# EAGLE design helloGame1.5 (EAGLE 8.6.3)
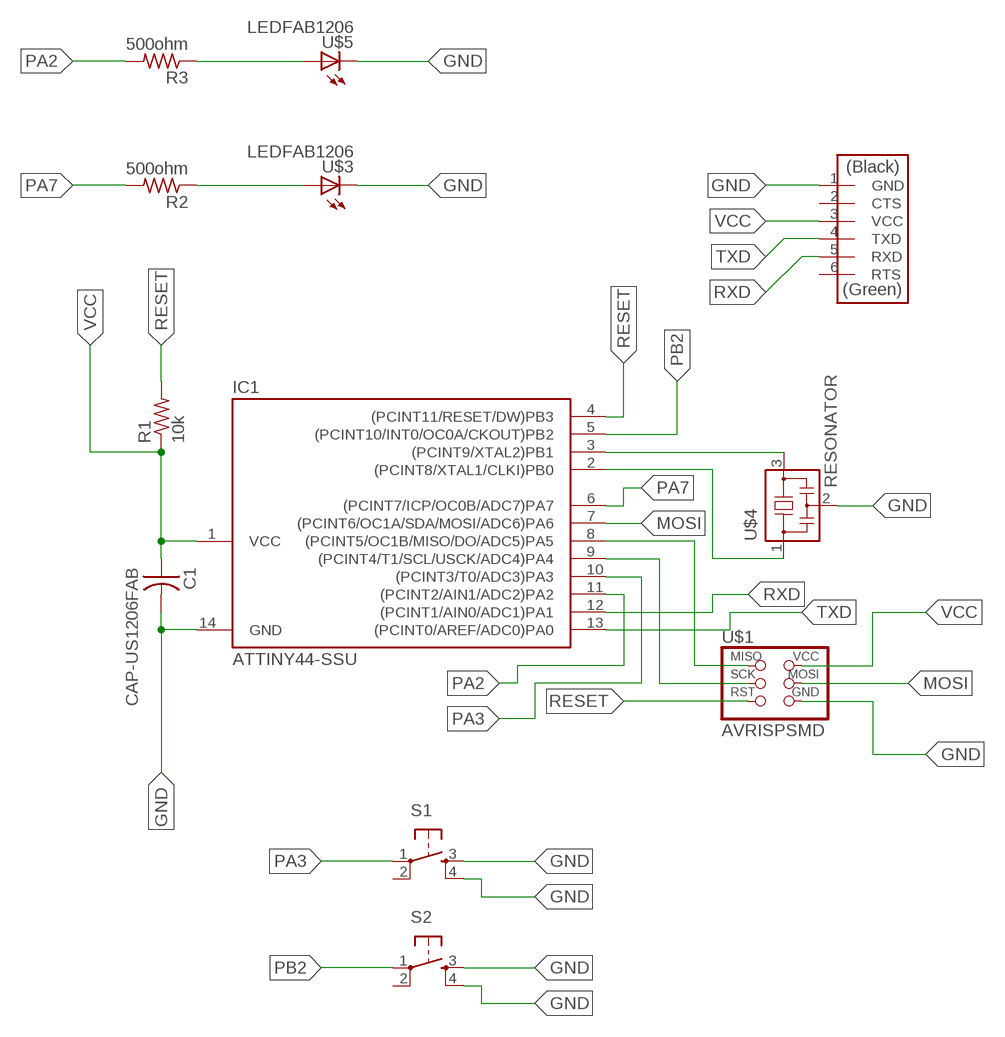
[diagram p0: schematic, sheet 1]

## Parts
C1  CAP-US1206FAB  [C1206FAB]
IC1  ATTINY44-SSU  [SOIC14]
R1  10k  RES-US1206FAB  [R1206FAB]
R2  500ohm  RES-US1206FAB  [R1206FAB]
R3  500ohm  RES-US1206FAB  [R1206FAB]
S1  6MM_SWITCH6MM_SWITCH  [6MM_SWITCH]
S2  6MM_SWITCH6MM_SWITCH  [6MM_SWITCH]
U$1  AVRISPSMD  [2X03SMD]
U$2  FTDI-SMD-HEADER  [1X06SMD]
U$3  LEDFAB1206  [LED1206FAB]
U$4  RESONATOR  [EFOBM]
U$5  LEDFAB1206  [LED1206FAB]

## Nets
GND: C1.2 IC1.14(GND) S1.3(S) S1.4(S1) S2.3(S) S2.4(S1) U$1.6(GND) U$2.1(GND) U$3.2(C) U$4.2 U$5.2(C)
MOSI: IC1.7((PCINT6/OC1A/SDA/MOSI/ADC6)PA6) U$1.4(MOSI)
N$2: IC1.3((PCINT9/XTAL2)PB1) U$4.3
N$3: IC1.2((PCINT8/XTAL1/CLKI)PB0) U$4.1
N$5: IC1.9((PCINT4/T1/SCL/USCK/ADC4)PA4) U$1.3(SCK)
N$6: IC1.8((PCINT5/OC1B/MISO/DO/ADC5)PA5) U$1.1(MISO)
N$7: R3.1 U$5.1(A)
N$11: R2.1 U$3.1(A)
PA2: IC1.11((PCINT2/AIN1/ADC2)PA2) R3.2
PA3: IC1.10((PCINT3/T0/ADC3)PA3) S1.1(P)
PA7: IC1.6((PCINT7/ICP/OC0B/ADC7)PA7) R2.2
PB2: IC1.5((PCINT10/INT0/OC0A/CKOUT)PB2) S2.1(P)
RESET: IC1.4((PCINT11/RESET/DW)PB3) R1.2 U$1.5(RST)
RXD: IC1.12((PCINT1/AIN0/ADC1)PA1) U$2.5(RXD)
TXD: IC1.13((PCINT0/AREF/ADC0)PA0) U$2.4(TXD)
VCC: C1.1 IC1.1(VCC) R1.1 U$1.2(VCC) U$2.3(VCC)
Unconnected: S1.2(P1) S2.2(P1) U$2.2(CTS) U$2.6(RTS)

## Library data of the parts
C1 = fab:CAP-US
IC1 = fab:ATTINY44
R1-R3 = fab:RES-US: Resistor (US Symbol) Variants with postfix FAB are widened to allow the routing of internal traces
S1 S2 = fab:6MM_SWITCH: OMRON SWITCH
U$1 = fab:AVRISP
U$2 = fab:FTDI-SMD-HEADER
U$3 U$5 = fab:LED: LED
U$4 = fab:RESONATOR

## Board
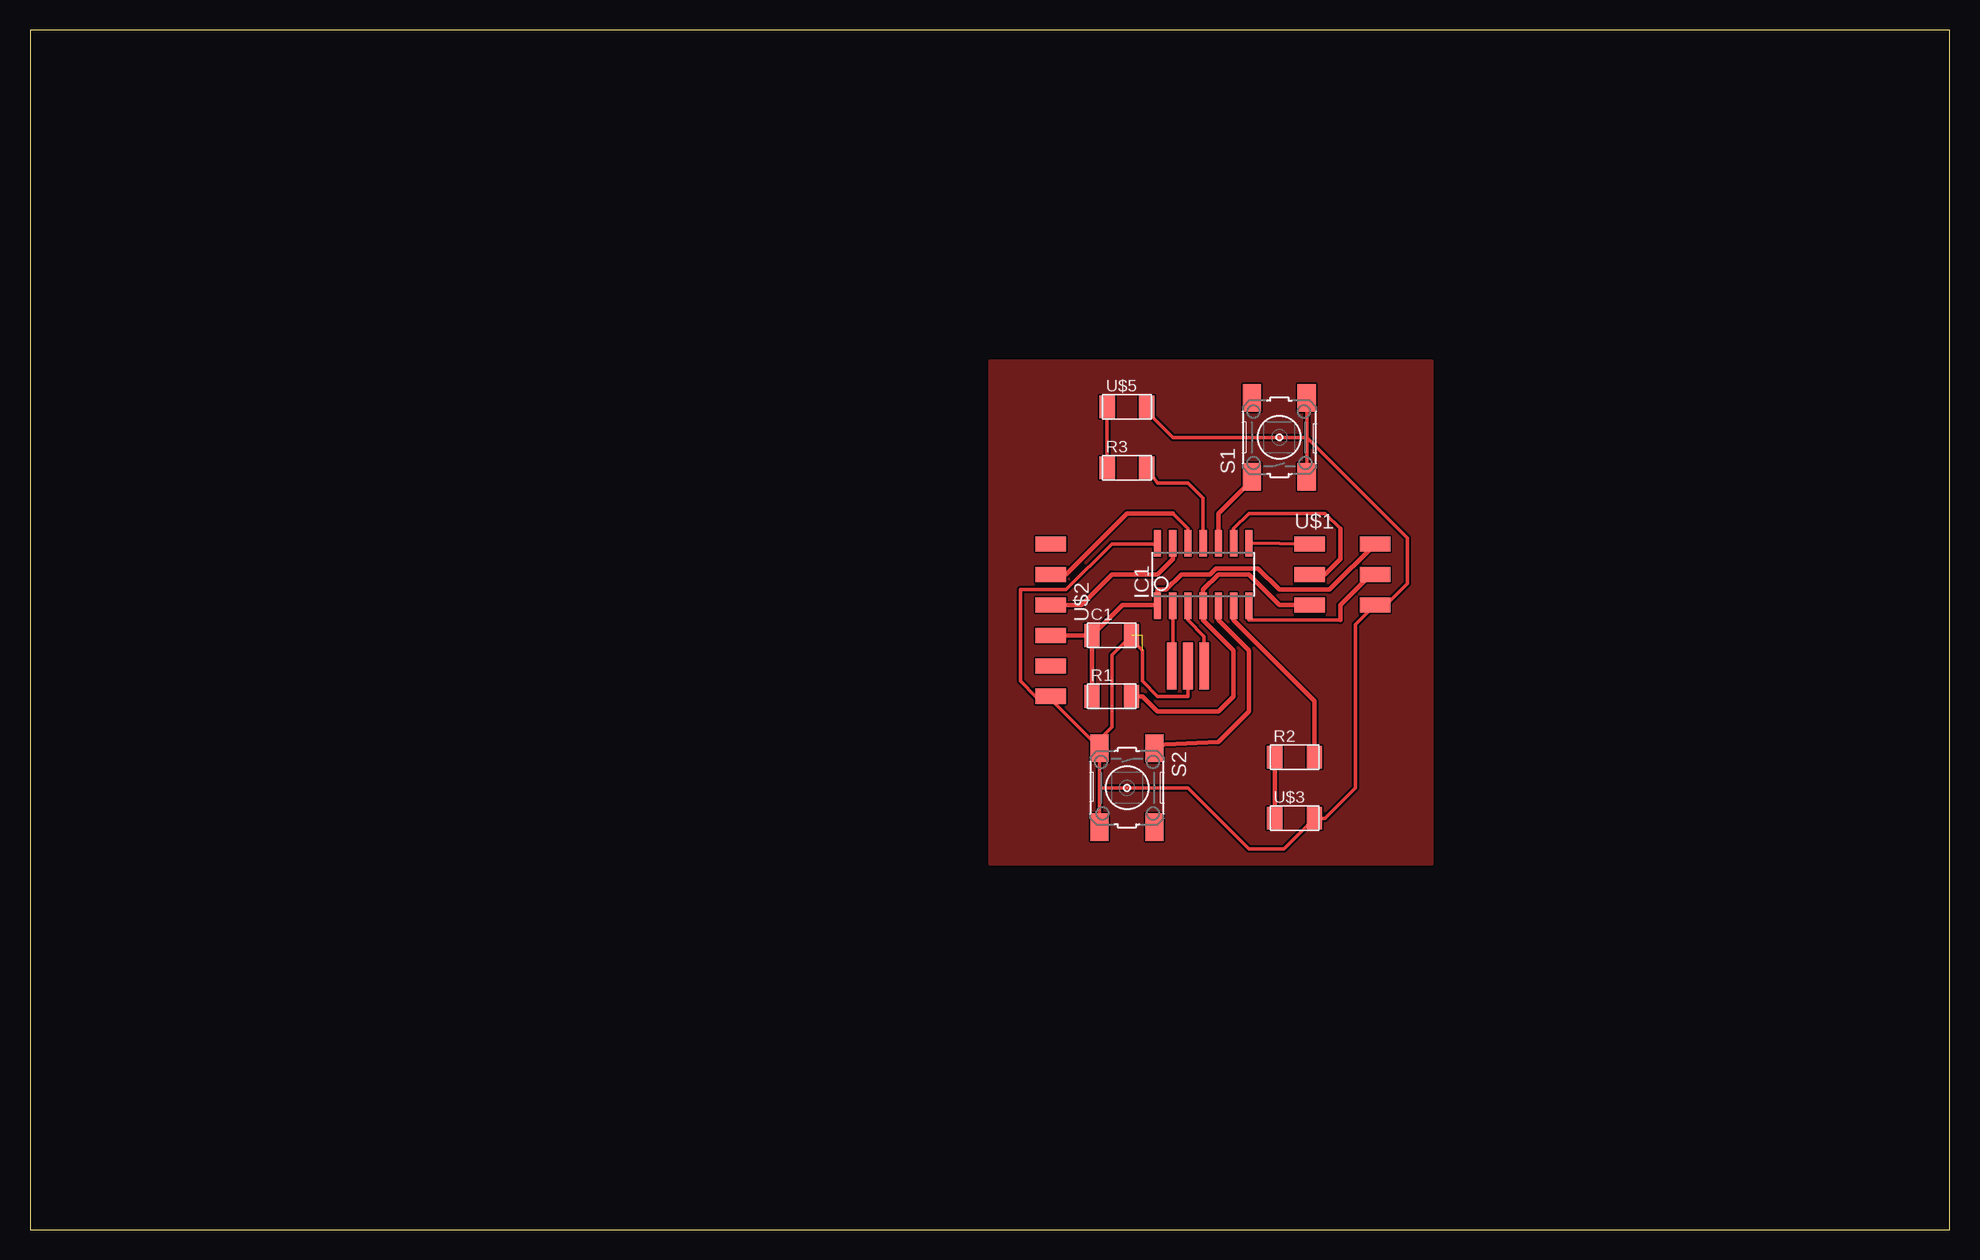
[diagram p1: board, top side]

Size 160 x 100 mm. Coordinates in mm from the lower left corner, seen from the top.
Outline: 0,0 160,0 160,100 0,100 0,0
Copper layers (1*16): Top 0.035mm / dielectric 1.5mm / Bottom 0.035mm
Design rules "default": minimum track width 6mil, minimum drill 0.35mm, track to track 6mil, track to pad 6mil, pad to pad 6mil, via to via 6mil, smd to smd 6mil, copper to edge 40mil, drill to drill 6mil, minimum pad ring 10mil, minimum via ring 8mil, stop-mask expansion 4mil, vias tented up to drill 0mil, thermal gap 10mil

### Footprints (pad centres in the part's own frame; a part is rotated, then mirrored left to right if it is on the bottom)
C1206FAB = smd 1.27 x 1.905: 1 -1.651,0; 2 1.651,0
SOIC14 = smd 0.61 x 2.21: 1 -3.81,-2.603; 2 -2.54,-2.603; 3 -1.27,-2.603; 4 0,-2.603; 5 1.27,-2.603; 6 2.54,-2.603; 7 3.81,-2.603; 8 3.81,2.603; 9 2.54,2.603; 10 1.27,2.603; 11 0,2.603; 12 -1.27,2.603; 13 -2.54,2.603; 14 -3.81,2.603
R1206FAB = smd 1.27 x 1.905: 1 -1.651,0; 2 1.651,0
6MM_SWITCH = smd 2.286 x 1.524: 1 -3.302,2.286; 2 3.302,2.286; 3 -3.302,-2.286; 4 3.302,-2.286
2X03SMD = smd 2.54 x 1.27: 1 -2.54,2.54; 2 2.92,2.54; 3 -2.54,0; 4 2.92,0; 5 -2.54,-2.54; 6 2.92,-2.54
1X06SMD = smd 2.54 x 1.27: 1 0,6.35; 2 0,3.81; 3 0,1.27; 4 0,-1.27; 5 0,-3.81; 6 0,-6.35
LED1206FAB = smd 1.27 x 1.905: 1 -1.651,0; 2 1.651,0
EFOBM = smd 0.8 x 3.9: 1 -1.35,0; 2 0,0; 3 1.35,0

### Placement (x,y rotation side)
C1  90.17,49.53 0 top
IC1  97.79,54.61 0 top
R1  90.17,44.45 0 top
R2  105.41,39.37 0 top
R3  91.44,63.5 0 top
S1  104.14,66.04 90 top
S2  91.44,36.83 270 top
U$1  109.22,54.61 0 top
U$2  85.09,50.8 180 top
U$3  105.41,34.29 0 top
U$4  96.52,46.99 0 top
U$5  91.44,68.58 0 top

### Tracks (layer width: path | path; a pad name or v marks a point on that pad's centre or on a via)
GND  (2 unrouted)
  Top 0.305: IC1.14 93.92,57.15 90.17,57.15 86.36,53.34 82.55,53.34 82.55,45.72 83.82,44.45 U$2.1 85.09,44.2 88.77,40.51 | 88.77,40.51 S2.3 89.15,36.83 | 89.15,36.83 S2.4 | 89.15,36.83 96.52,36.83 101.6,31.75 104.52,31.75 U$3.2 107.95,34.29 110.49,36.83 110.49,50.42 111.95,51.88 | U$1.6 111.95,51.88 | S1.4 106.43,66.04 | 106.43,66.04 S1.3 | 106.43,66.04 95.25,66.04 93.09,68.2 U$5.2 | 106.43,66.04 114.81,57.66 114.81,53.85 112.84,51.88 111.95,51.88 | U$4.2 96.52,44.45 93.98,44.45 92.71,45.72 92.71,48.26 91.63,49.34 | C1.2 91.63,49.34 | 91.63,49.34 90.17,47.88 90.17,41.91 88.77,40.51
MOSI
  Top 0.152: 101.6,50.8 IC1.7
  Top 0.305: 101.6,50.8 109.22,50.8
  Top 0.356: 109.22,50.8 109.22,52.07 111.76,54.61 U$1.4
N$1
  pour Top: 80.01,30.48 80.01,72.39 116.84,72.39 116.84,30.48
N$2
  Top 0.305: U$4.3 97.87,49.45 96.52,50.8 IC1.3
N$3
  Top 0.305: U$4.1 95.25,47.07 IC1.2
N$5
  Top 0.305: 109.22,58.42 107.95,59.69 101.6,59.69 100.33,58.42 IC1.9
  Top 0.356: U$1.3 107.95,54.61 109.22,55.88 109.22,58.42
N$6
  Top 0.305: U$1.1 IC1.8
N$7
  Top 0.305: R3.1 U$5.1
N$11
  Top 0.356: U$3.1 R2.1
PA2
  Top 0.305: IC1.11 97.79,60.96 96.52,62.23 93.98,62.23 R3.2
PA3
  Top 0.356: IC1.10 99.06,59.69 101.85,62.48 S1.1
PA7
  Top 0.356: IC1.6 100.33,50.8 107.06,44.07 R2.2
PB2
  Top 0.356: IC1.5 99.06,50.8 101.6,48.26 101.6,43.18 99.06,40.64 93.73,40.39 S2.1
RESET
  Top 0.356: U$1.5 104.14,52.07 101.6,54.61 99.06,54.61 97.79,53.34 IC1.4 97.79,50.8 100.33,48.26 100.33,44.45 99.06,43.18 93.98,43.18 92.71,44.45 R1.2
RXD
  Top 0.305: IC1.12 96.52,58.42 95.25,59.69
  Top 0.356: 95.25,59.69 91.44,59.69 86.36,54.61 U$2.5
TXD
  Top 0.356: U$2.4 87.63,52.07 90.17,54.61 93.98,54.61 95.25,55.88 IC1.13
VCC
  Top 0.356: U$1.2 108.33,53.34 104.14,53.34 102.36,55.12 98.85,55.12 98.34,54.61 95.97,54.61 94.7,53.34 93.98,53.34 IC1.1 93.92,52.07 91.06,52.07 C1.1 | R1.1 C1.1 | U$2.3 C1.1